# Altium schematic sheet MAP.SchDoc
size A
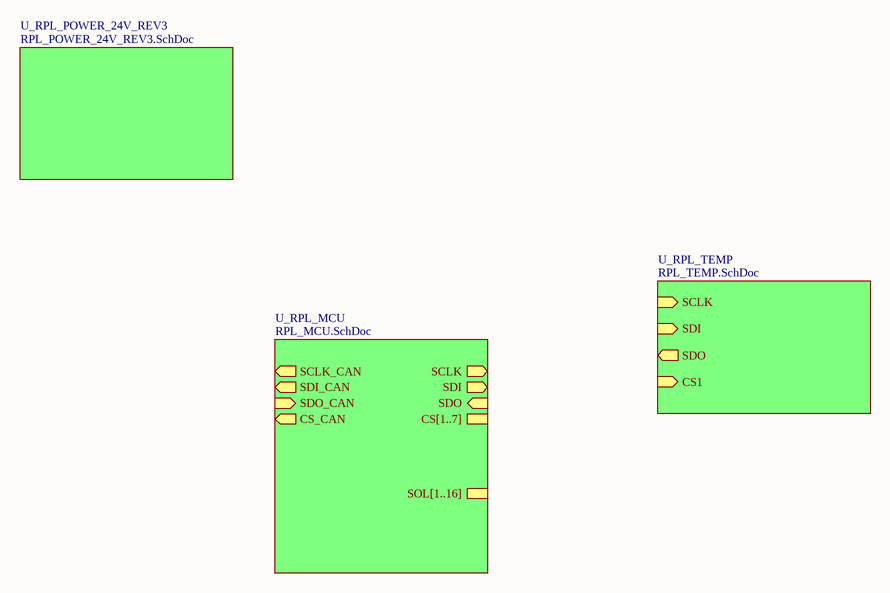
[diagram p0: MAP.SchDoc]

## Sub-sheets
U_RPL_MCU = RPL_MCU.SchDoc: SDI (out), SCLK (out), SDO (in), SDI_CAN (out), SCLK_CAN (out), SDO_CAN (in), CS_CAN (out), CS[1..7], SOL[1..16]
U_RPL_POWER_24V_REV3 = RPL_POWER_24V_REV3.SchDoc: no entries
U_RPL_TEMP = RPL_TEMP.SchDoc: SDI (in), SCLK (in), CS1 (in), SDO (out)

## Notes on the sheet
- Title:
- DrawnBy:
- Revision:
- SheetNumber:
- Date: